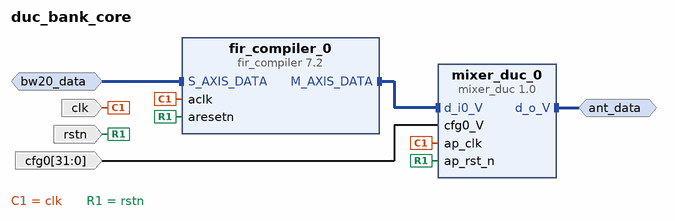
[diagram p0: block diagram of the top level]
# Vivado block design duc_bank_core, xczu9eg-ffvb1156-2-e, Vivado 2018.3
create_bd_design duc_bank_core

create_bd_intf_port -mode Slave -vlnv xilinx.com:interface:axis_rtl:1.0 bw20_data
set_property -dict [list \
  CONFIG.CLK_DOMAIN duc_bank_core_clk \
  CONFIG.FREQ_HZ 200000000 \
  CONFIG.HAS_TKEEP 0 \
  CONFIG.HAS_TLAST 0 \
  CONFIG.HAS_TREADY 1 \
  CONFIG.HAS_TSTRB 0 \
  CONFIG.LAYERED_METADATA undef \
  CONFIG.TDATA_NUM_BYTES 4 \
  CONFIG.TDEST_WIDTH 0 \
  CONFIG.TID_WIDTH 0 \
  CONFIG.TUSER_WIDTH 0 \
] [get_bd_intf_ports bw20_data]
create_bd_intf_port -mode Master -vlnv xilinx.com:interface:acc_fifo_write_rtl:1.0 ant_data
create_bd_port -dir I -type clk clk
set_property -dict {CONFIG.ASSOCIATED_BUSIF bw20_data CONFIG.FREQ_HZ 200000000} [get_bd_ports clk]
create_bd_port -dir I -type rst rstn
create_bd_port -dir I -from 31 -to 0 -type data cfg0
set_property -dict [list \
  CONFIG.LAYERED_METADATA {xilinx.com:interface:datatypes:1.0 {DATA {datatype {name {attribs {resolve_type immediate dependency {} format string minimum {} maximum {}} value {}} bitwidth {attribs {resolve_type immediate dependency {} format long minimum {} maximum {}} value 32} bitoffset {attribs {resolve_type immediate dependency {} format long minimum {} maximum {}} value 0} integer {signed {attribs {resolve_type immediate dependency {} format bool minimum {} maximum {}} value true}}}}}} \
] [get_bd_ports cfg0]

create_bd_cell -type ip -vlnv xilinx.com:ip:fir_compiler:7.2 fir_compiler_0
set_property -dict [list \
  CONFIG.Clock_Frequency 300.0 \
  CONFIG.CoefficientVector 1055,-3782,7171,24017,7171,-3782,1055 \
  CONFIG.Coefficient_Fractional_Bits 0 \
  CONFIG.Coefficient_Sets 1 \
  CONFIG.Coefficient_Sign Signed \
  CONFIG.Coefficient_Structure Symmetric \
  CONFIG.Coefficient_Width 16 \
  CONFIG.ColumnConfig 1 \
  CONFIG.Data_Width 16 \
  CONFIG.Decimation_Rate 1 \
  CONFIG.Filter_Architecture Systolic_Multiply_Accumulate \
  CONFIG.Filter_Type Interpolation \
  CONFIG.Has_ARESETn true \
  CONFIG.Interpolation_Rate 2 \
  CONFIG.M_DATA_Has_TREADY true \
  CONFIG.Number_Channels 1 \
  CONFIG.Number_Paths 2 \
  CONFIG.Output_Rounding_Mode Symmetric_Rounding_to_Infinity \
  CONFIG.Output_Width 16 \
  CONFIG.Quantization Integer_Coefficients \
  CONFIG.RateSpecification Output_Sample_Period \
  CONFIG.SamplePeriod 4 \
  CONFIG.Sample_Frequency 0.001 \
  CONFIG.Zero_Pack_Factor 1 \
] [get_bd_cells fir_compiler_0]
create_bd_cell -type ip -vlnv xilinx.com:hls:mixer_duc:1.0 mixer_duc_0

# ---- connections ----

connect_bd_intf_net [get_bd_intf_ports bw20_data] [get_bd_intf_pins fir_compiler_0/S_AXIS_DATA]
connect_bd_intf_net [get_bd_intf_pins mixer_duc_0/d_i0_V] [get_bd_intf_pins fir_compiler_0/M_AXIS_DATA]
connect_bd_intf_net [get_bd_intf_ports ant_data] [get_bd_intf_pins mixer_duc_0/d_o_V]
connect_bd_net [get_bd_ports clk] [get_bd_pins fir_compiler_0/aclk] [get_bd_pins mixer_duc_0/ap_clk]
connect_bd_net [get_bd_ports rstn] [get_bd_pins fir_compiler_0/aresetn] [get_bd_pins mixer_duc_0/ap_rst_n]
connect_bd_net -net cfg0_1 [get_bd_ports cfg0] [get_bd_pins mixer_duc_0/cfg0_V]

validate_bd_design
save_bd_design
